# EAGLE design XbeeHAT_V1.0b (EAGLE 9.4.2)
VER: V1.0.7 Oct. 2016

## Sheet 1 of 2
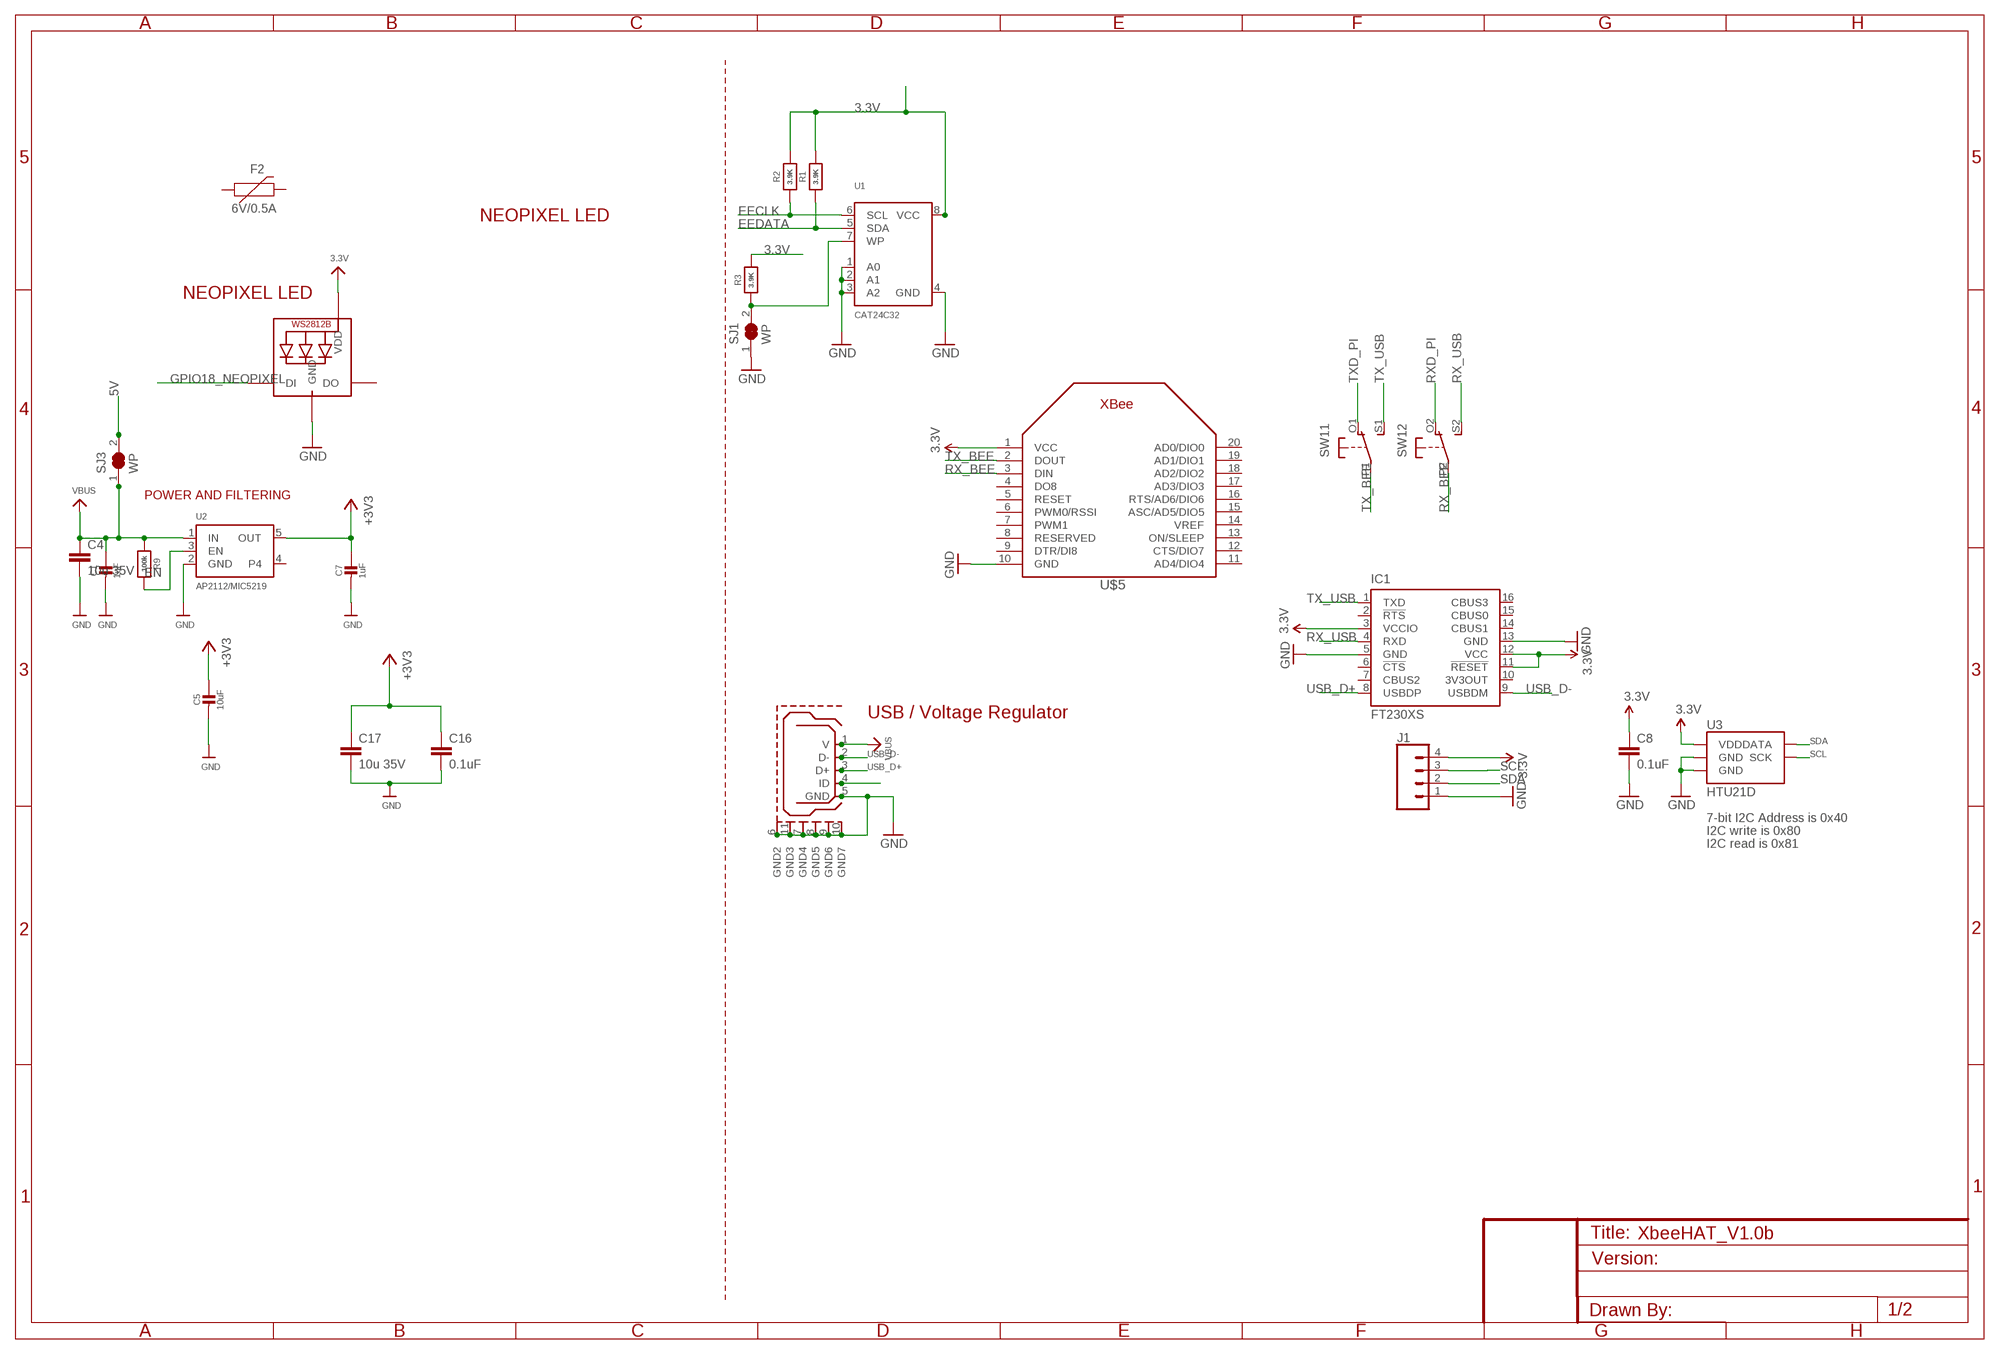
[diagram p0: schematic, sheet 1]

### Parts
798-ZX62-B-5PA1  USB_MICROB  [USB_MICROB_PACKAGE]
C1  1uF  CAP_CERAMIC0603_NO  [0603-NO]
C4  10u 35V  C-EUC1210  [C1210]
C5  10uF  CAP_CERAMIC0805-NOOUTLINE  [0805-NO]
C7  1uF  CAP_CERAMIC0603_NO  [0603-NO]
C8  0.1uF  0.1UF-25V(+80/-20%)(0603)  [0603-CAP]
C16  0.1uF  C-EUC0805  [C0805]
C17  10u 35V  C-EUC1210  [C1210]
F2  6V/0.5A  PPTC_HALF-AMP  [1206]
IC1  FT230XS  [SSOP16]
J1  CONN_04  [1X04]
LED  WS2812B3535  [LED3535]
R1  3.9K  RESISTOR0805_NOOUTLINE  [0805-NO@1]
R2  3.9K  RESISTOR0805_NOOUTLINE  [0805-NO@1]
R3  3.9K  RESISTOR0805_NOOUTLINE  [0805-NO@1]
R9  100k  RESISTOR_0603_NOOUT  [0603-NO@1]
SJ1  WP  SOLDERJUMPER_CLOSED  [SOLDERJUMPER_CLOSEDWIRE]
SJ3  WP  SOLDERJUMPER_CLOSED  [SOLDERJUMPER_CLOSEDWIRE]
SW1  DPDT-EG1390  [EG1390]
U1  CAT24C32  EEPROM_I2C_SOIC8_GENERIC  [SOIC8_150MIL]
U2  AP2112/MIC5219  VREG_SOT23-5  [SOT23-5]
U3  HTU21D  HTU21DSMD  [HTU21D]
U$5  XBEE  [XBEE]

### Nets
3.3V: C5.1 C7.1 C8.1 C16.1 C17.1 IC1.3(VCCIO) IC1.11(!RESET) IC1.12(VCC) LED.2(VDD) R1.2 R2.2 R3.2 U1.8(VCC) U2.5(OUT) U3.VDD U$5.1(VCC) ; supply symbol labelled +3V3 ; also sheet 2
5V: SJ3.2 ; also sheet 2
EECLK: R2.1 U1.6(SCL)
EEDATA: R1.1 U1.5(SDA) ; also sheet 2
EN: R9.2 U2.3(EN)
GND: 798-ZX62-B-5PA1.5(GND) 798-ZX62-B-5PA1.6(GND2) 798-ZX62-B-5PA1.7(GND4) 798-ZX62-B-5PA1.8(GND5) 798-ZX62-B-5PA1.9(GND6) 798-ZX62-B-5PA1.10(GND7) 798-ZX62-B-5PA1.11(GND3) C1.2 C4.2 C5.2 C7.2 C8.2 C16.2 C17.2 IC1.5(GND) IC1.13(GND) J1.1 LED.4(GND) SJ1.1 U1.1(A0) U1.2(A1) U1.3(A2) U1.4(GND) U2.2(GND) U3.7(GND) U3.GND U$5.10(GND) ; also sheet 2
GPIO18_NEOPIXEL: LED.1(DI) ; also sheet 2
N$16: R3.1 SJ1.2 U1.7(WP)
N$28: 798-ZX62-B-5PA1.4(ID)
RX_BEE: SW1.P2(2:P) U$5.3(DIN)
RX_USB: IC1.4(RXD) SW1.S2(2:S)
RXD_PI: SW1.O2(2:O) ; also sheet 2
SCL: J1.3 U3.SCK ; also sheet 2
SDA: J1.2 U3.DATA ; also sheet 2
TX_BEE: SW1.P1(1:P) U$5.2(DOUT)
TX_USB: IC1.1(TXD) SW1.S1(1:S)
TXD_PI: SW1.O1(1:O) ; also sheet 2
USB_D+: 798-ZX62-B-5PA1.3(D+) IC1.8(USBDP)
USB_D-: 798-ZX62-B-5PA1.2(D-) IC1.9(USBDM)
VBUS: 798-ZX62-B-5PA1.1(V) C1.1 C4.1 R9.1 SJ3.1 U2.1(IN)
VCC: J1.4 ; supply symbol labelled 3.3V
Unconnected: F2.1 F2.2 IC1.2(!RTS) IC1.6(!CTS) IC1.7(CBUS2) IC1.10(3V3OUT) IC1.14(CBUS1) IC1.15(CBUS0) IC1.16(CBUS3) LED.3(DO) U2.4 U$5.4(DO8) U$5.5(RESET) U$5.6(PWM0/RSSI) U$5.7(PWM1) U$5.8(RESERVED) U$5.9(DTR/DI8) U$5.11(AD4/DIO4) U$5.12(CTS/DIO7) U$5.13(ON/SLEEP) U$5.14(VREF) U$5.15(ASC/AD5/DIO5) U$5.16(RTS/AD6/DIO6) U$5.17(AD3/DIO3) U$5.18(AD2/DIO2) U$5.19(AD1/DIO1) U$5.20(AD0/DIO0)

### Notes on the sheet
- NEOPIXEL LED
- NEOPIXEL LED
- POWER AND FILTERING
- USB / Voltage Regulator
- 7-bit I2C Address is 0x40
- I2C write is 0x80
- I2C read is 0x81

## Sheet 2 of 2
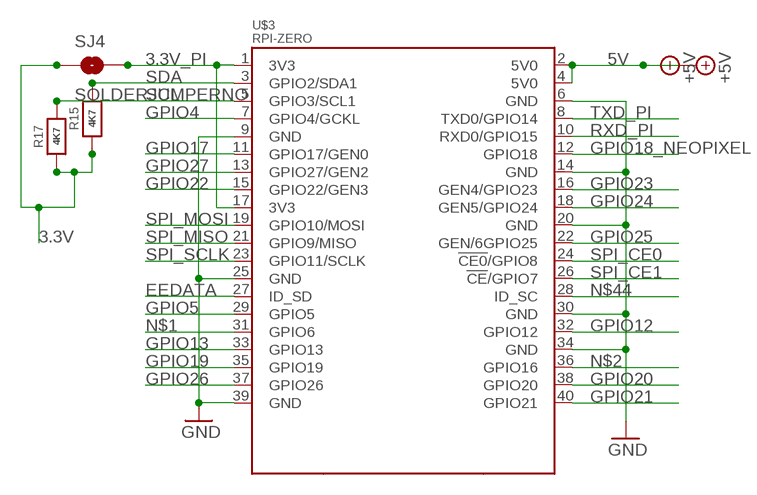
[diagram p1: schematic, sheet 2]

### Parts
R15  4K7  RESISTOR0805_NOOUTLINE  [0805-NO@1]
R17  4K7  RESISTOR0805_NOOUTLINE  [0805-NO@1]
SJ4  SOLDERJUMPERNO  [SJ_2S-NO]
U$3  RPI-ZERO  [RASPBERRYPI_BASTELSTUBE_V13_RASPI_BOARD_B+_FULL]

### Nets
3.3V: R15.1 R17.1 SJ4.1 ; also sheet 1
3.3V_PI: SJ4.2 U$3.1(3V3) U$3.17(3V3)
5V: U$3.2(5V0) U$3.4(5V0) ; supply symbol labelled +5V ; also sheet 1
EEDATA: U$3.27(ID_SD) ; also sheet 1
GND: U$3.6(GND) U$3.9(GND) U$3.14(GND) U$3.20(GND) U$3.25(GND) U$3.30(GND) U$3.34(GND) U$3.39(GND) ; also sheet 1
GPIO4: U$3.7(GPIO4/GCKL)
GPIO5: U$3.29(GPIO5)
GPIO12: U$3.32(GPIO12)
GPIO13: U$3.33(GPIO13)
GPIO17: U$3.11(GPIO17/GEN0)
GPIO18_NEOPIXEL: U$3.12(GPIO18) ; also sheet 1
GPIO19: U$3.35(GPIO19)
GPIO20: U$3.38(GPIO20)
GPIO21: U$3.40(GPIO21)
GPIO22: U$3.15(GPIO22/GEN3)
GPIO23: U$3.16(GEN4/GPIO23)
GPIO24: U$3.18(GEN5/GPIO24)
GPIO25: U$3.22(GEN/6GPIO25)
GPIO26: U$3.37(GPIO26)
GPIO27: U$3.13(GPIO27/GEN2)
N$1: U$3.31(GPIO6)
N$2: U$3.36(GPIO16)
N$44: U$3.28(ID_SC)
RXD_PI: U$3.10(RXD0/GPIO15) ; also sheet 1
SCL: R17.2 U$3.5(GPIO3/SCL1) ; also sheet 1
SDA: R15.2 U$3.3(GPIO2/SDA1) ; also sheet 1
SPI_CE0: U$3.24(!CE0!/GPIO8)
SPI_CE1: U$3.26(!CE!/GPIO7)
SPI_MISO: U$3.21(GPIO9/MISO)
SPI_MOSI: U$3.19(GPIO10/MOSI)
SPI_SCLK: U$3.23(GPIO11/SCLK)
TXD_PI: U$3.8(TXD0/GPIO14) ; also sheet 1

## Library data of the parts
798-ZX62-B-5PA1 = femtoduino:USB_MICROB: This is the hirose ZX62-B-5PA(11) MICRO-USB B Type female connection.
C1 C5 C7 = microbuilder:CAP_CERAMIC: Ceramic Capacitors For new designs, use the packages preceded by an '_' character since they are more reliable: The following footprints should be used on most boards: _0402 - Standard footprint for regular board layouts _0603 - Standard footprint for regular board layouts _0805 - Standard footprint for regular board layouts _1206 - Standard footprint for regular board layouts For extremely tight-pitch boards where space is at a premium, the following 'micro-pitch' footprints can be used (smaller pads, no silkscreen outline, etc.): _0402MP - Micro-pitch footprint for very dense/compact boards _0603MP - Micro-pitch footprint for very dense/compact boards _0805MP - Micro-pitch footprint for very dense/compact boards _1206MP - Micro-pitch footprint for very dense/compact boards
C4 C17 = SmartPrj:C-EU: CAPACITOR, European symbol
C8 = SparkFun-Capacitors:0.1UF-25V(+80/-20%)(0603): CAP-00810 Ceramic Standard decoupling cap; PROD_ID: CAP-00810
C16 = rcl:C-EU: CAPACITOR, European symbol
F2 = SparkFun-Fuses:PPTC: Resettable Fuse PPTC Resettable Fuse. Really a sort of resistor with a polymeric positive temperature coefficient whose resistance increases dramatically with an increase in temperature. When heated by the power passing through the resistance rises causing the current to be limited, protecting the circuit. This is achieved by the transition of the polymer from a crystalline to an amorphous state where the conductive carbon separates breaking the conductive pathways found in the cool crystalline structure. When a PPTC cools back down it resumes conducting letting the circuit turn back on. SparkFun Products: SparkFun RedBoard - Programmed with Arduino <https://www.sparkfun.com/products/12757> Pro Micro - 5V/16MHz <https://www.sparkfun.com/products/12640> Arduino Pro 328 - 5V/16MHz <https://www.sparkfun.com/products/10915> MP3 Trigger <https://www.sparkfun.com/products/13720>; PROD_ID: RES-08585
IC1 = ftdichip:FT230X: USB to BASIC UART IC Auto generated by make-symbol-device-package-bsdl.ulp Rev. 43 Source: Data sheet <http://www.ftdichip.com/Support/Documents/DataSheets/ICs/DS_FT230X.pdf>
J1 = SparkFun-Connectors:CONN_04: Multi connection point. Often used as Generic Header-pin footprint for 0.1 inch spaced/style header connections On any of the 0.1 inch spaced packages, you can populate with these: Break Away Headers - Straight <https://www.sparkfun.com/products/116> (PRT-00116) Break Away Male Headers - Right Angle <https://www.sparkfun.com/products/553> (PRT-00553) Female Headers <https://www.sparkfun.com/products/115> (PRT-00115) Break Away Headers - Machine Pin <https://www.sparkfun.com/products/117> (PRT-00117) Break Away Female Headers - Swiss Machine Pin <https://www.sparkfun.com/products/743> (PRT-00743) For SCREWTERMINALS and SPRING TERMINALS visit here: Screw Terimnals on SparkFun.com <https://www.sparkfun.com/search/results?term=Screw+Terminals> (5mm/3.5mm/2.54mm spacing) This device is also useful as a general connection point to wire up your design to another part of your project. Our various solder wires solder well into these plated through hole pads. Hook-Up Wire - Assortment (Stranded, 22 AWG) <https://www.sparkfun.com/products/11375> (PRT-11375) Hook-Up Wire - Assortment (Solid Core, 22 AWG) <https://www.sparkfun.com/products/11367> (PRT-11367) View the entire wire category on our website here <https://www.sparkfun.com/categories/141> Special notes: Molex polarized connector foot print use with SKU : PRT-08231 with associated crimp pins and housings. 1MM SMD Version SKU: PRT-10208; PROD_ID: CONN-09696
LED = microbuilder:WS2812B
R1-R3 R9 R15 R17 = microbuilder:RESISTOR: Resistors For new designs, use the packages preceded by an '_' character since they are more reliable: The following footprints should be used on most boards: _0402 - Standard footprint for regular board layouts _0603 - Standard footprint for regular board layouts _0805 - Standard footprint for regular board layouts _1206 - Standard footprint for regular board layouts For extremely tight-pitch boards where space is at a premium, the following 'micro-pitch' footprints can be used (smaller pads, no silkscreen outline, etc.): _0402MP - Micro-pitch footprint for very dense/compact boards _0603MP - Micro-pitch footprint for very dense/compact boards _0805MP - Micro-pitch footprint for very dense/compact boards _1206MP - Micro-pitch footprint for very dense/compact boards
SJ1 SJ3 = microbuilder:SOLDERJUMPER_CLOSED: Solder Jumper - Closed These solder jumpers are closed by default CLOSEDWIRE - 10 mil trace between pads that can be cut and resoldered later CLOSEDPERM - 63 mil trace between pads for a permanent connection (used to 'bridge' two signals, a shameless hack for Eagle). Can double as a test point as well (no cream layer)
SJ4 = SparkFun:SOLDERJUMPER: Solder Jumper Standard SMD solder jumper. Used to automate production. Two varients : Normally Open and Normally Closed are the same, but have different paste layers. NC will have a large amount of paste and should jumper during reflow.
SW1 = adafruit:DPDT
U1 = microbuilder:EEPROM_I2C_SOIC8_GENERIC: Note: The same pinout is used for many I2C EEPROMs in SOIC8(150mil) from a variety of manufacturers and in various sizes. Examples: 16K (2K x 8 Bit) I2C EEPROM 1.7-5.5V, 400KHz, -40°C-85°C Digikey: CAT24C16WI-GT3CT-ND 256K (32K x 8 Bit) I2C EEPROM 1.7-5.5V, 400KHz, -40°C-85°C Digikey: 24AA256-I/SN-ND
U2 = microbuilder:VREG_SOT23-5: SOT23-5 Fixed Voltage Regulators Part Current Out V Out V In V Dropout θJA (°C/W) TJ (°C) Digikey Part No. ADP121 150mA 3.3V 3.4-5.5V 0.09V @ 150mA -- -- ADP121-AUJZ33R7CT-ND ADP121 150mA 3.0V 3.1-5.5V 0.09V @ 150mA -- -- ADP121-AUJZ30R7CT-ND ADP122 300mA 3.3V 3.4-5.5V 0.085V @ 300mA -- -- ADP122AUJZ-3.3-R7CT-ND ADP1712 300mA 3.3V 3.5-5.5V 0.17V @ 300mA -- -- ADP1712AUJZ-3.3-R7TR-ND AP7311 (Low Cost) 150mA 3.3V 3.5-6V 0.15V @ 150mA -- -- AP7311-33WG-7DICT-ND LD39015M18R 150mA 1.8V 1.9V-5.5V 0.08V @ 100mA -- -- 497-6977-1-ND LP2985A-33DBVR 150mA 3.3V 3.3-16V 0.28V @ 150mA 206 150 296-18479-1-ND MCP1824T-3302E/OT 300mA 3.3V 3.5V-6V 0.2V @ 300mA -- -- MCP1824T-3302E/OTCT-ND MIC5205-2.5YM5 TR 150mA 2.5V 2.7-16V 0.165V @ 150mA -- -- 576-1257-2-ND MIC5205-3.0YM5 TR 150mA 3.0V 3.2V-16V 0.165V @ 150mA -- -- 576-1258-2-ND MIC5205-3.3YM5 TR 150mA 3.3V 3.5V-16V 0.165V @ 150mA -- -- 576-1259-2-ND TPS780330220 150mA 3.3V+2.2V 3.6-5.5V 250mV Max -- -- 296-23332-1-ND TDA3663/N1,135 100mA 3.3V 3.5-45V 0.18V @ 50mA -- -- 568-5343-1-ND Max operating temp can be calculated using θJA, TJ (max junction temperature), and power in watts. Set the "Maximum Ambient Temperature" until it reaches TJ ("Max Junction Temperature"), which is the absolute limit for safe use of the regulator: Heat Sink Temperature Calculator <http://www.daycounter.com/Calculators/Heat-Sink-Temperature-Calculator.phtml> For example, With 12V source into a 3.3V LP2985 and a 30mA load, we are dissipating (12V-3.3V) * 0.03A = 0.261W. With a θJA of 206 °C/W, a TJ of 150°C, and 261mW we can safely use the chip without a heat sink up to 75°C (=147.1°C Junction Temperature).
U3 = SparkFun-Sensors:HTU21D; PROD_ID: IC-11793
U$3 = RPI-Zero:RPI-ZERO
U$5 = adafruit:XBEE

## Net classes
1 power: width 0.254 mm

## Board
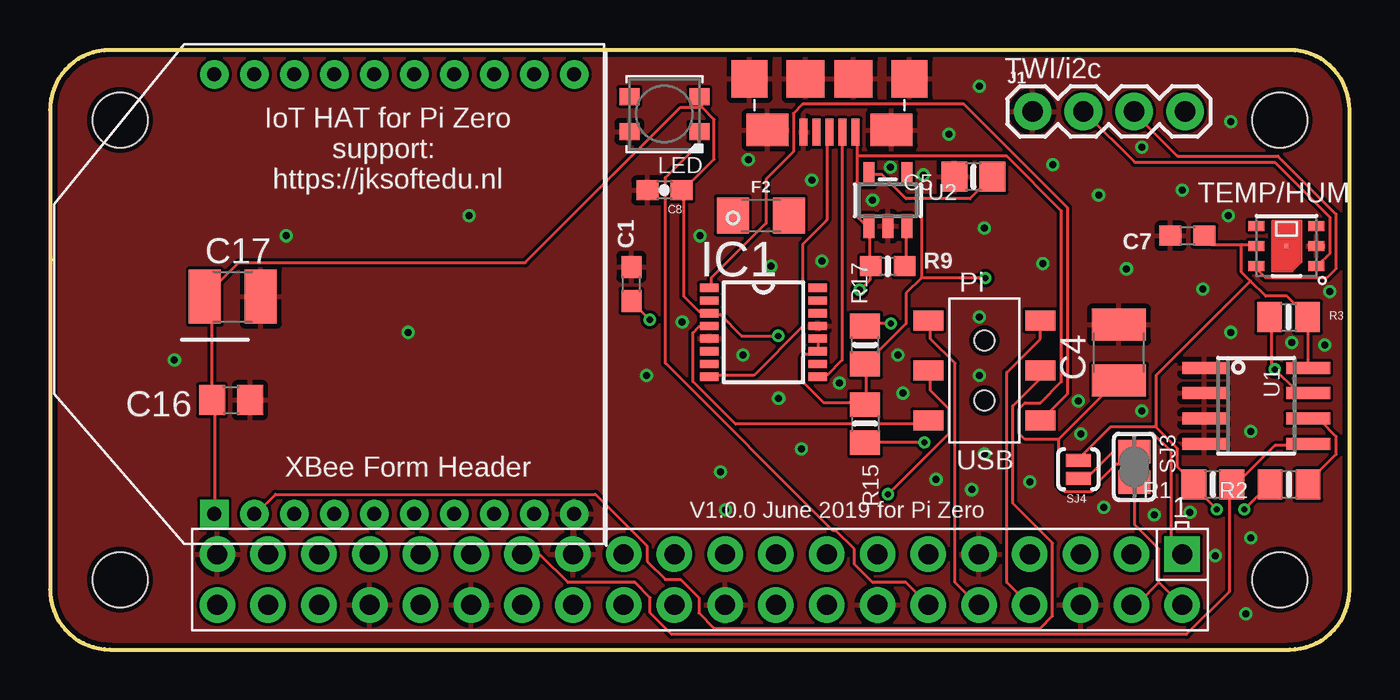
[diagram p2: board, top side]
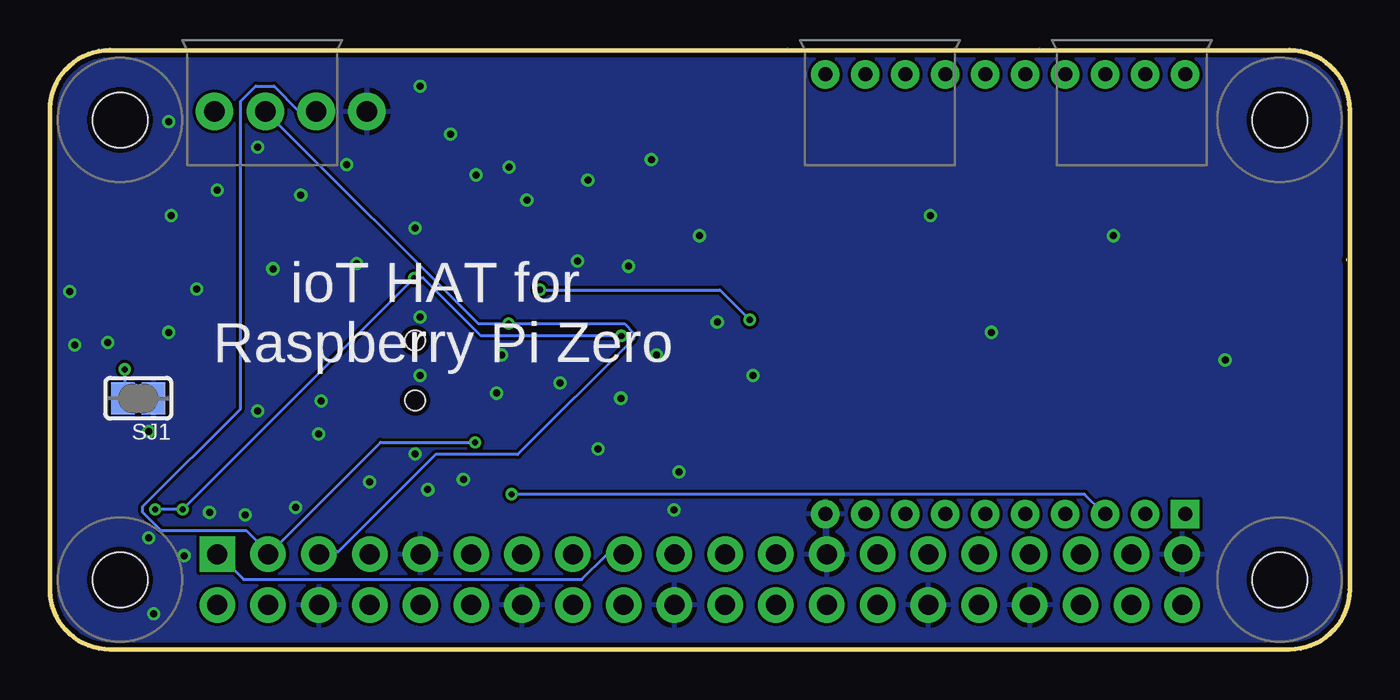
[diagram p3: board, bottom side, seen from below]

Size 65 x 30 mm. Coordinates in mm from the lower left corner, seen from the top.
Outline: 0.13,19.43 0.13,19.56
Outline: 0,27 0,3 arc90 3,0 62,0 arc90 65,3 65,27 arc90 62,30 3,30 arc90 0,27
Copper layers (1*16): Top 0.035mm / dielectric 1.5mm / Bottom 0.035mm
Design rules "seeed-studio-2-layer": minimum track width 6mil, minimum drill 12mil, track to track 6mil, track to pad 6mil, pad to pad 6mil, via to via 6mil, smd to smd 0mil, copper to edge 10mil, drill to drill 10mil, minimum pad ring 10mil, minimum via ring 6mil, stop-mask expansion 2mil, vias tented up to drill 100mil, thermal gap 10mil

### Footprints (pad centres in the part's own frame; a part is rotated, then mirrored left to right if it is on the bottom)
USB_MICROB_PACKAGE = smd 0.4 x 1.35: 1 -1.3,-0.68; 2 -0.64,-0.68; 3 0,-0.68; 4 0.66,-0.68; 5 1.3,-0.68 | smd 2.1 x 1.6: 6 -3.1,-0.8; 11 3.1,-0.8 | smd 1.8 x 1.9: 7 -4,-3.35; 10 4,-3.35 | smd 1.9 x 1.9: 8 -1.2,-3.35; 9 1.2,-3.35
0603-NO = smd 1.1 x 1: 1 -0.85,0; 2 0.85,0
C1210 = smd 1.6 x 2.7: 1 -1.4,0; 2 1.4,0
0805-NO = smd 1.3 x 1.5: 1 -0.95,0; 2 0.95,0
0603-CAP = smd 1.1 x 1: 1 -0.85,0; 2 0.85,0
C0805 = smd 1.3 x 1.5: 1 -0.95,0; 2 0.95,0
1206 = smd 1.6 x 1.8: 1 -1.4,0; 2 1.4,0
SSOP16 = smd 0.914 x 0.406: 1 -2.718,2.223; 2 -2.718,1.587; 3 -2.718,0.953; 4 -2.718,0.318; 5 -2.718,-0.318; 6 -2.718,-0.953; 7 -2.718,-1.587; 8 -2.718,-2.223; 9 2.718,-2.223; 10 2.718,-1.587; 11 2.718,-0.953; 12 2.718,-0.318; 13 2.718,0.318; 14 2.718,0.953; 15 2.718,1.587; 16 2.718,2.223
1X04 = drill 1.016 pad 1.88: 1 0,0; 2 2.54,0; 3 5.08,0; 4 7.62,0
LED3535 = smd 1 x 0.85: 1 -1.75,0.875; 2 -1.75,-0.875; 3 1.75,-0.875; 4 1.75,0.875
0805-NO@1 = smd 1.24 x 1.5: 1 -0.95,0; 2 0.95,0
0603-NO@1 = smd 1.075 x 1: 1 -0.85,0; 2 0.85,0
SOLDERJUMPER_CLOSEDWIRE = smd 1.168 x 1.6: 1 -0.762,0; 2 0.762,0 | smd 0.635 x 0.203: WIRE 0,0
SJ_2S-NO = smd 0.635 x 1.27: 1 -0.45,0; 2 0.45,0
EG1390 = smd 1 x 1.5: O1 -2.5,2.8; O2 -2.5,-2.8; P1 0,2.8; P2 0,-2.8; S1 2.5,2.8; S2 2.5,-2.8 | hole 1: 1.5,0; -1.5,0
SOIC8_150MIL = smd 0.6 x 2.2: 1 -1.905,-2.6; 2 -0.635,-2.6; 3 0.635,-2.6; 4 1.905,-2.6; 5 1.905,2.6; 6 0.635,2.6; 7 -0.635,2.6; 8 -1.905,2.6
SOT23-5 = smd 0.55 x 1.2: 1 -0.95,-1.3; 2 0,-1.3; 3 0.95,-1.3; 4 0.95,1.3; 5 -0.95,1.3
HTU21D = smd 0.2 x 0.2: 7 0,0 | smd 0.8 x 0.5: DATA 1.5,-1; GND 1.5,0; NC@1 -1.5,1; NC@6 1.5,1; SCK -1.5,-1; VDD -1.5,0
RASPBERRYPI_BASTELSTUBE_V13_RASPI_BOARD_B+_FULL = drill 1 pad 1.778 square: 1 8.37,25.23 | drill 1 pad 1.778: 2 8.37,27.77; 3 10.91,25.23; 4 10.91,27.77; 5 13.45,25.23; 6 13.45,27.77; 7 15.99,25.23; 8 15.99,27.77; 9 18.53,25.23; 10 18.53,27.77; 11 21.07,25.23; 12 21.07,27.77; 13 23.61,25.23; 14 23.61,27.77; 15 26.15,25.23; 16 26.15,27.77; 17 28.69,25.23; 18 28.69,27.77; 19 31.23,25.23; 20 31.23,27.77; 21 33.77,25.23; 22 33.77,27.77; 23 36.31,25.23; 24 36.31,27.77; 25 38.85,25.23; 26 38.85,27.77; 27 41.39,25.23; 28 41.39,27.77; 29 43.93,25.23; 30 43.93,27.77; 31 46.47,25.23; 32 46.47,27.77; 33 49.01,25.23; 34 49.01,27.77; 35 51.55,25.23; 36 51.55,27.77; 37 54.09,25.23; 38 54.09,27.77; 39 56.63,25.23; 40 56.63,27.77 | hole 2.75: 3.5,3.5; 3.5,26.5; 61.5,3.5; 61.5,26.5
XBEE = drill 0.7 pad 1.422 square: 1 -11,5.5 | drill 0.7 pad 1.422: 2 -11,3.5; 3 -11,1.5; 4 -11,-0.5; 5 -11,-2.5; 6 -11,-4.5; 7 -11,-6.5; 8 -11,-8.5; 9 -11,-10.5; 10 -11,-12.5; 11 11,-12.5; 12 11,-10.5; 13 11,-8.5; 14 11,-6.5; 15 11,-4.5; 16 11,-2.5; 17 11,-0.5; 18 11,1.5; 19 11,3.5; 20 11,5.5

### Placement (x,y rotation side)
798-ZX62-B-5PA1  38.99,25.2 180 top
C1  29.08,18.29 90 top
C4  53.47,14.86 90 top
C5  46.2,23.65 180 top
C7  56.9,20.7 180 top
C8  30.73,22.99 180 top
C16  9.05,12.49 0 top
C17  9.14,17.65 0 top
F2  35.56,21.72 0 top
IC1  35.69,15.88 0 top
J1  49.15,26.92 0 top
LED  30.73,26.8 180 top
R1  58.17,8.26 180 top
R2  61.98,8.26 180 top
R3  61.95,16.63 0 top
R9  41.91,19.18 0 top
R15  40.77,11.3 270 top
R17  40.77,15.24 90 top
SJ1  60.58,12.57 180 bottom
SJ3  54.23,9.14 270 top
SJ4  51.44,9.02 270 top
SW1  46.74,13.97 270 top
U1  60.33,12.19 270 top
U2  41.91,22.48 0 top
U3  61.85,20.19 0 top
U$3  65,30 180 top
U$5  13.72,17.78 90 top

### Tracks (layer width: path | path; a pad name or v marks a point on that pad's centre or on a via)
3.3V  (via drill 0.3)
  Top 0.152: IC1.12 IC1.11 38.41,14.78 37.8,14.78 37.64,14.63 37.64,13.41 38.71,12.34 40.69,12.34 R15.1 40.84,12.34 40.84,14.17 R17.1 40.84,14.33 42.82,16.31 42.82,17.83 43.59,18.59 | 43.59,22.55 46.02,22.55 47.09,23.62 C5.1 | 43.59,22.55 42.82,22.55 41.6,23.77 41,23.77 U2.5 | 43.59,22.55 43.59,18.59 | 55.32,11.12 53.03,11.12 51.51,9.6 SJ4.1 | 55.32,11.12 56.39,10.06 56.39,9.14 57.15,8.38 R1.2 57.15,8.23 v58.37,7.01 | v59.74,7.01 60.96,8.23 R2.2 | 59.59,20.27 58.06,20.27 57.76,20.57 C7.1 | 59.59,20.27 60.2,20.27 U3.VDD | U1.8 62.94,14.17 62.94,16.61 R3.2 62.79,16.76 61.87,17.68 60.81,17.68 60.05,18.44 | 59.59,20.27 59.59,18.9 60.05,18.44 | 55.32,11.12 55.32,13.72 60.05,18.44 | v46.79,18.59 43.59,18.59 | 32.61,27.13 32.61,27.58 LED.2 | 32.61,27.13 33.22,26.52 33.22,24.54 31.7,23.01 C8.1 31.7,22.86 31.7,17.68 32.46,16.92 32.92,16.92 IC1.3 33.07,16.76 33.53,16.76 34.59,15.7 v36.42,15.7 | U$5.1 8.23,6.86 8.23,12.34 C16.1 8.08,12.5 8.08,17.22 7.77,17.53 C17.1 7.77,17.68 9.45,19.36 23.77,19.36 31.55,27.13 32.61,27.13
  Bottom 0.152: v59.74,7.01 v58.37,7.01 v46.79,18.59 46.33,18.59 43.43,15.7 v36.42,15.7
3.3V_PI
  Top 0.152: SJ4.2 51.51,8.69 51.97,8.69 53.19,9.91 53.19,10.67 53.34,10.82 55.17,10.82 56.08,9.91 56.08,5.33 56.54,4.88 U$3.1
  Bottom 0.152: U$3.17 36.42,4.72 37.19,4.72 38.41,3.5 55.32,3.5 56.54,4.72 U$3.1
5V
  Top 0.152: 55.47,3.35 55.47,5.03 54.25,6.25 54.25,8.38 SJ3.2 | 55.47,3.35 56.54,2.29 U$3.2 | 55.47,3.35 54.41,2.29 54.1,2.29 U$3.4
EECLK
  Top 0.152: R2.1 62.94,8.38 64.31,9.75 64.31,10.67 63.55,11.43 62.94,11.43 U1.6
EEDATA
  Top 0.152: U1.5 62.79,10.21 61.27,10.21 59.44,8.38 59.13,8.38 R1.1 58.98,8.23 58.98,2.9 56.84,0.76 31.09,0.76 30.02,1.83 30.02,2.59 29.26,3.35 25.91,3.35 24.54,4.72 23.62,4.72 U$3.27
EN
  Top 0.152: R9.2 42.82,19.2 42.82,21.03 U2.3
GND  (via drill 0.35)
  Top 0.152: 62.94,20.27 62.99,20.24 | IC1.13 38.5,16 38.5,16.17
  other vias: 17.91,15.88 20.95,21.72 36.07,19.18 38.61,19.43 32.51,20.7 31.62,16.38 34.67,14.73 29.84,13.72 36.45,12.57 37.59,10.03 42.67,12.83 39.5,13.34 42.42,14.73 46.48,16.64 46.48,13.72 44.32,8.51 46.1,8 46.74,9.78 49.02,8.38 52.7,7.11 55.24,6.73 57.02,6.86 58.29,4.7 60.07,5.59 60.07,10.92 62.1,15.37 63.75,15.24 59.05,15.88 57.66,18.03 53.85,19.05 49.66,19.3 56.64,22.99 52.45,22.73 50.16,24.26 46.74,21.08 44.96,25.78 46.48,28.19 54.61,25.15 59.05,26.42 58.93,21.72 64.01,17.91 51.44,12.45 51.56,10.79 54.61,11.94 59.82,1.78 33.53,8.89 33.78,6.99 6.22,14.48 11.81,20.7 38.1,23.5 34.92,24.51 41.15,22.48 42.04,24.13 43.69,23.75
  pour Top: -6.35,35.69 -6.35,-3.68 -6.1,-3.94 68.07,-3.94 68.33,-3.68 68.33,35.81 68.58,36.07 -6.22,36.07 -6.6,35.69
  pour Bottom: -5.08,36.45 -5.08,-2.92 -4.83,-3.17 69.34,-3.17 69.6,-2.92 69.6,36.58 69.85,36.83 -4.95,36.83 -5.33,36.45
GPIO18_NEOPIXEL
  Top 0.152: LED.1 32.46,25.91 32.46,25.3 30.79,23.62 30.79,14.33 39.17,5.94 39.32,5.94 40.23,5.03 40.23,4.27 41.15,3.35 42.82,3.35 43.89,2.29 U$3.12
N$16  (via drill 0.3)
  Top 0.152: R3.1 61.11,16.61 61.11,14.17 v61.27,14.02 62.33,12.95 62.79,12.95 U1.7
  Bottom 0.152: v61.27,14.02 61.27,12.65 SJ1.2
RX_BEE  (via drill 0.3)
  Top 0.152: v41.91,7.77 44.96,10.82 44.96,12.04 44.04,12.95 44.04,13.87 SW1.P2
  Bottom 0.152: v41.91,7.77 13.26,7.77 12.34,6.86 U$5.3
RX_USB
  Top 0.152: IC1.4 32.92,16.15 32.46,16.15 32.16,15.85 32.16,13.41 34.29,11.28 43.74,11.28 43.89,11.43 SW1.S2
RXD_PI
  Top 0.152: SW1.O2 44.04,16.46 44.04,15.54 45.26,14.33 45.26,3.35 46.33,2.29 U$3.10
SCL  (via drill 0.3)
  Top 0.152: U3.SCK 60.35,19.05 60.81,18.59 63.86,18.59 64.31,19.05 64.31,21.79 61.42,24.69 56.39,24.69 54.25,26.82 J1.3 | v42.06,16.31 40.84,16.31 R17.2
  Bottom 0.152: J1.3 54.1,26.82 43.59,16.31 v42.06,16.31 36.27,16.31 35.81,15.85 35.81,15.54 41.6,9.75 45.72,9.75 50.6,4.88 51.51,4.88 U$3.5
SDA  (via drill 0.3)
  Top 0.152: U3.DATA 63.4,19.2 64.01,19.81 64.01,21.64 61.27,24.38 54.25,24.38 51.82,26.82 J1.2 | v43.74,10.36 40.84,10.36 R15.2
  Bottom 0.152: v43.74,10.36 48.46,10.36 53.95,4.88 U$3.3 54.1,4.88 55.17,5.94 59.44,5.94 60.35,6.86 60.35,7.16 55.47,12.04 55.47,27.43 54.71,28.19 53.8,28.19 52.58,26.98 51.82,26.98 J1.2
TX_BEE
  Top 0.152: SW1.P1 49.53,13.87 49.53,13.56 48.16,12.19 48.16,7.32 50.14,5.33 50.14,1.68 49.53,1.07 33.22,1.07 32.46,1.83 32.46,2.59 31.55,3.5 30.79,3.5 29.87,4.42 29.87,5.18 27.28,7.77 11.28,7.77 10.36,6.86 U$5.2
TX_USB
  Top 0.152: IC1.1 33.07,18.14 33.07,18.59 35.81,21.34 35.81,23.55 37.19,24.92 37.19,26.82 37.64,27.28 45.72,27.28 50.9,22.1 50.9,12.8 49.68,11.58 SW1.S1
TXD_PI
  Top 0.152: SW1.O1 49.53,16.46 49.53,15.54 47.85,13.87 47.85,3.35 48.92,2.29 U$3.8
USB_D+
  Top 0.152: IC1.8 33.07,13.72 35.2,13.72 37.64,16.15 37.64,20.27 38.86,21.49 38.86,26.06 798-ZX62-B-5PA1.3
USB_D-
  Top 0.152: IC1.9 38.41,13.72 38.86,13.72 39.62,14.48 39.62,26.06 798-ZX62-B-5PA1.2
VBUS  (via drill 0.3)
  Top 0.152: 40.39,24.69 40.39,21.64 40.84,21.18 U2.1 41,21.03 41,19.2 R9.1 41,19 41,18.5 v40.5,18 | 40.39,24.69 40.39,26.06 798-ZX62-B-5PA1.1 | 50.44,10.52 50.44,8.23 50.75,7.92 52.12,7.92 52.43,8.23 52.43,8.38 53.34,9.3 53.49,9.3 54.1,9.91 SJ3.1 | 50.44,10.52 53.34,13.41 C4.1 | 40.39,24.69 47.85,24.69 50.6,21.95 50.6,13.41 49.53,12.34 48.77,12.34 48.46,12.04 48.46,10.82 48.77,10.52 50.44,10.52 | v30,16.5 29.5,17 C1.1
  Bottom 0.152: v30,16.5 31.5,18 v40.5,18

### Text on the board
tNames: Pi | USB
_bSilk: ioT HAT for / Raspberry Pi Zero
_tSilk: TWI/i2c | IoT HAT for Pi Zero / support: / https://jksoftedu.nl | TEMP/HUM | XBee Form Header